# Altium schematic sheet FPGA_QDRII.SchDoc: FPGA_QDRII
size A4 portrait; Date: 18/06/2014; DrawnBy: J. Gabriel R.E.; Organization: Seven Solutions S.L.; Address1: C/Baza, Parcela 19, Nave 3; Address2: Polígono Ind. Juncaril; Address3: 18210-Peligros-Granada; Address4: Spain; Revision: 3.4; SheetNumber: 12; SheetTotal: 23; WebAddress: www.sevensols.com; Project: White Rabbit; ProjectName: Project Name
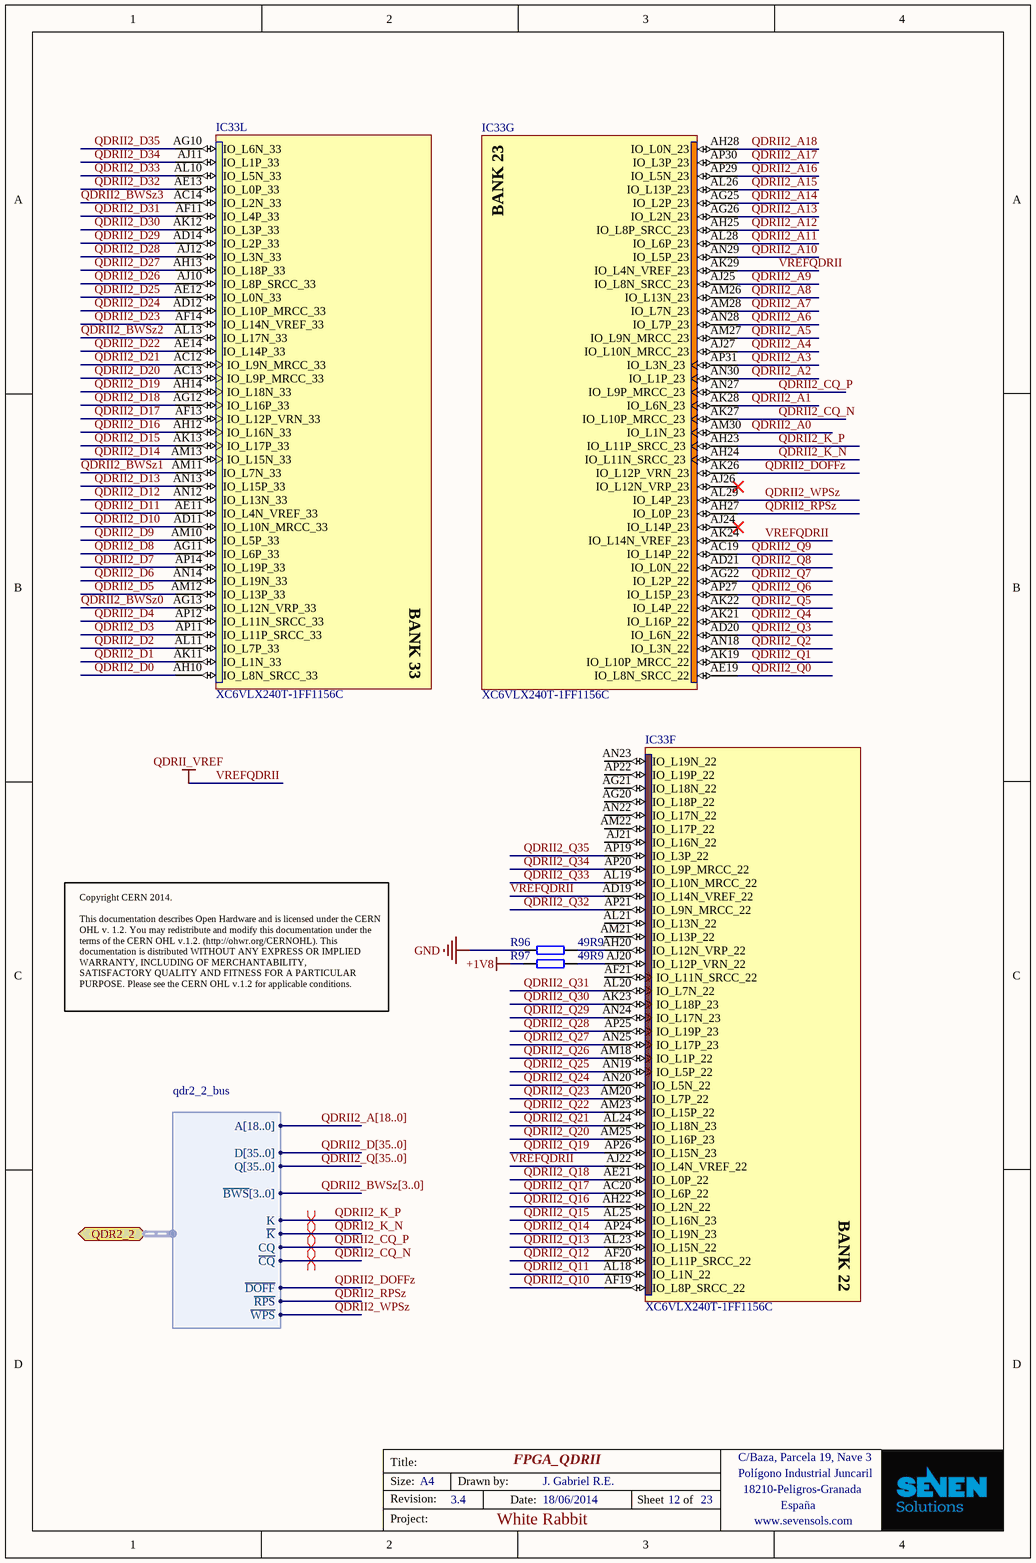
[diagram p0: FPGA_QDRII.SchDoc]

## Parts
IC33  XC6VLX240T-1FF1156C  [FF1156]  (parts F,G,L of 20)
R96  value 49R9  [0402]  (hidden comment: 49R9 (not mounted))
R97  value 49R9  [0402]  (hidden comment: 49R9 (not mounted))

## Ports
QDR2_2 (harness qdr2_2_bus)

## Harnesses
qdr2_2_bus: A[18..0], ~{BWS}[3..0], ~{CQ}, CQ, D[35..0], ~{DOFF}, K, ~{K}, Q[35..0], ~{RPS}, ~{WPS}

## Nets
+1V8: R97.2
GND: R96.2
VREFQDRII: IC33.AD19(IO_L14N_VREF_22) IC33.AJ22(IO_L4N_VREF_22) IC33.AK24(IO_L14N_VREF_23) IC33.AK29(IO_L4N_VREF_23)  [also labelled QDRII_VREF]
QDRII2_A0: IC33.AM30(IO_L1N_23)
QDRII2_A1: IC33.AK28(IO_L6N_23)
QDRII2_A2: IC33.AN30(IO_L1P_23)
QDRII2_A3: IC33.AP31(IO_L3N_23)
QDRII2_A4: IC33.AJ27(IO_L10N_MRCC_23)
QDRII2_A5: IC33.AM27(IO_L9N_MRCC_23)
QDRII2_A6: IC33.AN28(IO_L7P_23)
QDRII2_A7: IC33.AM28(IO_L7N_23)
QDRII2_A8: IC33.AM26(IO_L13N_23)
QDRII2_A9: IC33.AJ25(IO_L8N_SRCC_23)
QDRII2_A10: IC33.AN29(IO_L5P_23)
QDRII2_A11: IC33.AL28(IO_L6P_23)
QDRII2_A12: IC33.AH25(IO_L8P_SRCC_23)
QDRII2_A13: IC33.AG26(IO_L2N_23)
QDRII2_A14: IC33.AG25(IO_L2P_23)
QDRII2_A15: IC33.AL26(IO_L13P_23)
QDRII2_A16: IC33.AP29(IO_L5N_23)
QDRII2_A17: IC33.AP30(IO_L3P_23)
QDRII2_A18: IC33.AH28(IO_L0N_23)
QDRII2_BWSz0: IC33.AG13(IO_L12N_VRP_33)
QDRII2_BWSz1: IC33.AM11(IO_L7N_33)
QDRII2_BWSz2: IC33.AL13(IO_L17N_33)
QDRII2_BWSz3: IC33.AC14(IO_L2N_33)
QDRII2_CQ_N: IC33.AK27(IO_L10P_MRCC_23) ; port QDR2_2.~{CQ}
QDRII2_CQ_P: IC33.AN27(IO_L9P_MRCC_23) ; port QDR2_2.CQ
QDRII2_D0: IC33.AH10(IO_L8N_SRCC_33)
QDRII2_D1: IC33.AK11(IO_L1N_33)
QDRII2_D2: IC33.AL11(IO_L7P_33)
QDRII2_D3: IC33.AP11(IO_L11P_SRCC_33)
QDRII2_D4: IC33.AP12(IO_L11N_SRCC_33)
QDRII2_D5: IC33.AM12(IO_L13P_33)
QDRII2_D6: IC33.AN14(IO_L19N_33)
QDRII2_D7: IC33.AP14(IO_L19P_33)
QDRII2_D8: IC33.AG11(IO_L6P_33)
QDRII2_D9: IC33.AM10(IO_L5P_33)
QDRII2_D10: IC33.AD11(IO_L10N_MRCC_33)
QDRII2_D11: IC33.AE11(IO_L4N_VREF_33)
QDRII2_D12: IC33.AN12(IO_L13N_33)
QDRII2_D13: IC33.AN13(IO_L15P_33)
QDRII2_D14: IC33.AM13(IO_L15N_33)
QDRII2_D15: IC33.AK13(IO_L17P_33)
QDRII2_D16: IC33.AH12(IO_L16N_33)
QDRII2_D17: IC33.AF13(IO_L12P_VRN_33)
QDRII2_D18: IC33.AG12(IO_L16P_33)
QDRII2_D19: IC33.AH14(IO_L18N_33)
QDRII2_D20: IC33.AC13(IO_L9P_MRCC_33)
QDRII2_D21: IC33.AC12(IO_L9N_MRCC_33)
QDRII2_D22: IC33.AE14(IO_L14P_33)
QDRII2_D23: IC33.AF14(IO_L14N_VREF_33)
QDRII2_D24: IC33.AD12(IO_L10P_MRCC_33)
QDRII2_D25: IC33.AE12(IO_L0N_33)
QDRII2_D26: IC33.AJ10(IO_L8P_SRCC_33)
QDRII2_D27: IC33.AH13(IO_L18P_33)
QDRII2_D28: IC33.AJ12(IO_L3N_33)
QDRII2_D29: IC33.AD14(IO_L2P_33)
QDRII2_D30: IC33.AK12(IO_L3P_33)
QDRII2_D31: IC33.AF11(IO_L4P_33)
QDRII2_D32: IC33.AE13(IO_L0P_33)
QDRII2_D33: IC33.AL10(IO_L5N_33)
QDRII2_D34: IC33.AJ11(IO_L1P_33)
QDRII2_D35: IC33.AG10(IO_L6N_33)
QDRII2_DOFFz: IC33.AK26(IO_L12P_VRN_23) ; port QDR2_2.~{DOFF}
QDRII2_K_N: IC33.AH24(IO_L11N_SRCC_23) ; port QDR2_2.~{K}
QDRII2_K_P: IC33.AH23(IO_L11P_SRCC_23) ; port QDR2_2.K
QDRII2_Q0: IC33.AE19(IO_L8N_SRCC_22)
QDRII2_Q1: IC33.AK19(IO_L10P_MRCC_22)
QDRII2_Q2: IC33.AN18(IO_L3N_22)
QDRII2_Q3: IC33.AD20(IO_L6N_22)
QDRII2_Q4: IC33.AK21(IO_L16P_22)
QDRII2_Q5: IC33.AK22(IO_L4P_22)
QDRII2_Q6: IC33.AP27(IO_L15P_23)
QDRII2_Q7: IC33.AG22(IO_L2P_22)
QDRII2_Q8: IC33.AD21(IO_L0N_22)
QDRII2_Q9: IC33.AC19(IO_L14P_22)
QDRII2_Q10: IC33.AF19(IO_L8P_SRCC_22)
QDRII2_Q11: IC33.AL18(IO_L1N_22)
QDRII2_Q12: IC33.AF20(IO_L11P_SRCC_22)
QDRII2_Q13: IC33.AL23(IO_L15N_22)
QDRII2_Q14: IC33.AP24(IO_L19N_23)
QDRII2_Q15: IC33.AL25(IO_L16N_23)
QDRII2_Q16: IC33.AH22(IO_L2N_22)
QDRII2_Q17: IC33.AC20(IO_L6P_22)
QDRII2_Q18: IC33.AE21(IO_L0P_22)
QDRII2_Q19: IC33.AP26(IO_L15N_23)
QDRII2_Q20: IC33.AM25(IO_L16P_23)
QDRII2_Q21: IC33.AL24(IO_L18N_23)
QDRII2_Q22: IC33.AM23(IO_L15P_22)
QDRII2_Q23: IC33.AM20(IO_L7P_22)
QDRII2_Q24: IC33.AN20(IO_L5N_22)
QDRII2_Q25: IC33.AN19(IO_L5P_22)
QDRII2_Q26: IC33.AM18(IO_L1P_22)
QDRII2_Q27: IC33.AN25(IO_L17P_23)
QDRII2_Q28: IC33.AP25(IO_L19P_23)
QDRII2_Q29: IC33.AN24(IO_L17N_23)
QDRII2_Q30: IC33.AK23(IO_L18P_23)
QDRII2_Q31: IC33.AL20(IO_L7N_22)
QDRII2_Q32: IC33.AP21(IO_L9N_MRCC_22)
QDRII2_Q33: IC33.AL19(IO_L10N_MRCC_22)
QDRII2_Q34: IC33.AP20(IO_L9P_MRCC_22)
QDRII2_Q35: IC33.AP19(IO_L3P_22)
QDRII2_RPSz: IC33.AH27(IO_L0P_23) ; port QDR2_2.~{RPS}
QDRII2_WPSz: IC33.AL29(IO_L4P_23) ; port QDR2_2.~{WPS}
NetIC33_AH20: IC33.AH20(IO_L12N_VRP_22) R96.1
NetIC33_AJ20: IC33.AJ20(IO_L12P_VRN_22) R97.1

Not connected (* = marked no-connect by the designer): IC33 AF21(IO_L11N_SRCC_22) AG20(IO_L18P_22) AG21(IO_L18N_22) AJ21(IO_L16N_22) AJ24(IO_L14P_23)* AJ26(IO_L12N_VRP_23)* AL21(IO_L13N_22) AM21(IO_L13P_22) AM22(IO_L17P_22) AN22(IO_L17N_22) AN23(IO_L19N_22) AP22(IO_L19P_22)

## Buses and harness runs
bus QDRII2_A[18..0]
bus QDRII2_BWSz[3..0]
bus QDRII2_D[35..0]
bus QDRII2_Q[35..0]

## Layout directives
differential pair: QDRII2_CQ_N, QDRII2_CQ_P, QDRII2_K_N, QDRII2_K_P

## Notes on the sheet
- Copyright CERN 2014.
  This documentation describes Open Hardware and is licensed under the CERN OHL v. 1.2. You may redistribute and modify this documentation under the terms of the CERN OHL v.1.2. (http://ohwr.org/CERNOHL). This documentation is distributed WITHOUT ANY EXPRESS OR IMPLIED WARRANTY, INCLUDING OF MERCHANTABILITY, SATISFACTORY QUALITY AND FITNESS FOR A PARTICULAR PURPOSE. Please see the CERN OHL v.1.2 for applicable conditions.
- Title:
- Size:
- Revision:
- A4
- Drawn by:
- Date:
- Sheet
- of
- C/Baza, Parcela 19, Nave 3
- Polígono Industrial Juncaril
- 18210-Peligros-Granada
- España
- Project:
- www.sevensols.com
- (in symbol XC6VLX130T-1FF1156C, part F) BANK 22
- (in symbol XC6VLX130T-1FF1156C, part G) BANK 23
- (in symbol XC6VLX130T-1FF1156C, part L) BANK 33

## Library data of the parts
IC33 = XC6VLX130T-1FF1156C: Virtex-6 LXT Platform FPGA, 600 User I/Os, 20 GTXs, 1156-Ball FFBGA, Speed Grade 1, Commercial Grade; FirstPublished: 17-Nov-2009; DatasheetVersion: v2.0, Sep-2009; PackageVersion: ver1.0, Jun-2009; PackageReference: FF1156; Publisher: Altium Limited; PackageDescription: 1156-Ball Flip-Chip Fine Pitch Ball Grid Array (FF1156); Code_JEDEC: MS-034-AAR-1; Code_IPC: BGA100P34X34-1156; ComponentLink1Description: Virtex-6 Datasheet; ComponentLink1URL: http://www.xilinx.com/support/documentation/data_sheets/ds150.pdf; ComponentLink2Description: Pinout Specification; ComponentLink2URL: http://www.xilinx.com/support/packagefiles/virtex-6-pkgs.htm; ComponentLink3Description: FF1156 Package Drawing; ComponentLink3URL: http://www.xilinx.com/support/documentation/package_specs/ff1156.pdf; ComponentLink4Description: Virtex-6 Documents; ComponentLink4URL: http://www.xilinx.com/support/documentation/virtex-6.htm; ComponentLink5Description: Xilinx.com Home; ComponentLink5URL: http://www.xilinx.com
R96 R97 = R0402_49R9_±1%_0.1W_100PPM: SMD Resistor; Manufacturer1: Panasonic; Manufacturer1 PN: ERJ-2RKF49R9X; TCR: 100ppm; Power Rating: 0.1W; Tolerance: ±1%; Case: 0402; Distributor1: DigiKey; Distributor1 PN: P49.9LCT-ND